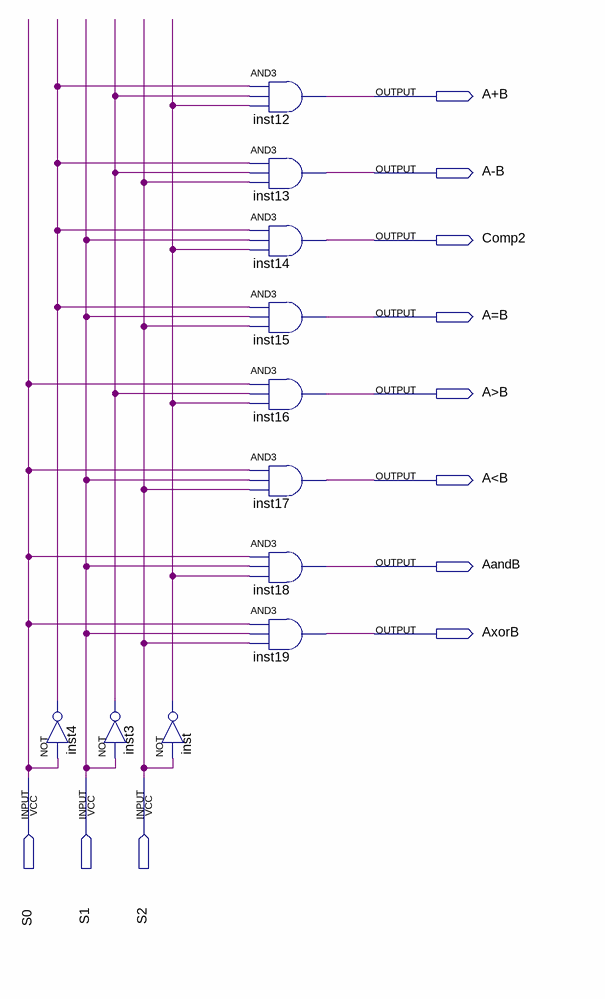
[diagram p0: schematic sheet]
// Quartus schematic operacao.bdf as structural Verilog: 11 symbols, 11 pins
module operacao (
  input  S0,
  input  S1,
  input  S2,
  output \A+B ,
  output \A-B ,
  output Comp2,
  output \A=B ,
  output \A>B ,
  output \A<B ,
  output AandB,
  output AxorB
);

  wire inst3_out, inst4_out, inst_out;

  not inst4 (inst4_out, S0);
  not inst3 (inst3_out, S1);
  not inst (inst_out, S2);
  and inst12 (\A+B , inst4_out, inst3_out, inst_out);
  and inst13 (\A-B , inst4_out, inst3_out, S2);
  and inst14 (Comp2, inst4_out, S1, inst_out);
  and inst15 (\A=B , inst4_out, S1, S2);
  and inst16 (\A>B , S0, inst3_out, inst_out);
  and inst17 (\A<B , S0, S1, S2);
  and inst18 (AandB, S0, S1, inst_out);
  and inst19 (AxorB, S0, S1, S2);
endmodule
